# Altium schematic sheet TopSheet.schdoc: Top Sheet
size A4; Organization1: Sciences of Technology Buchs; Size: A4
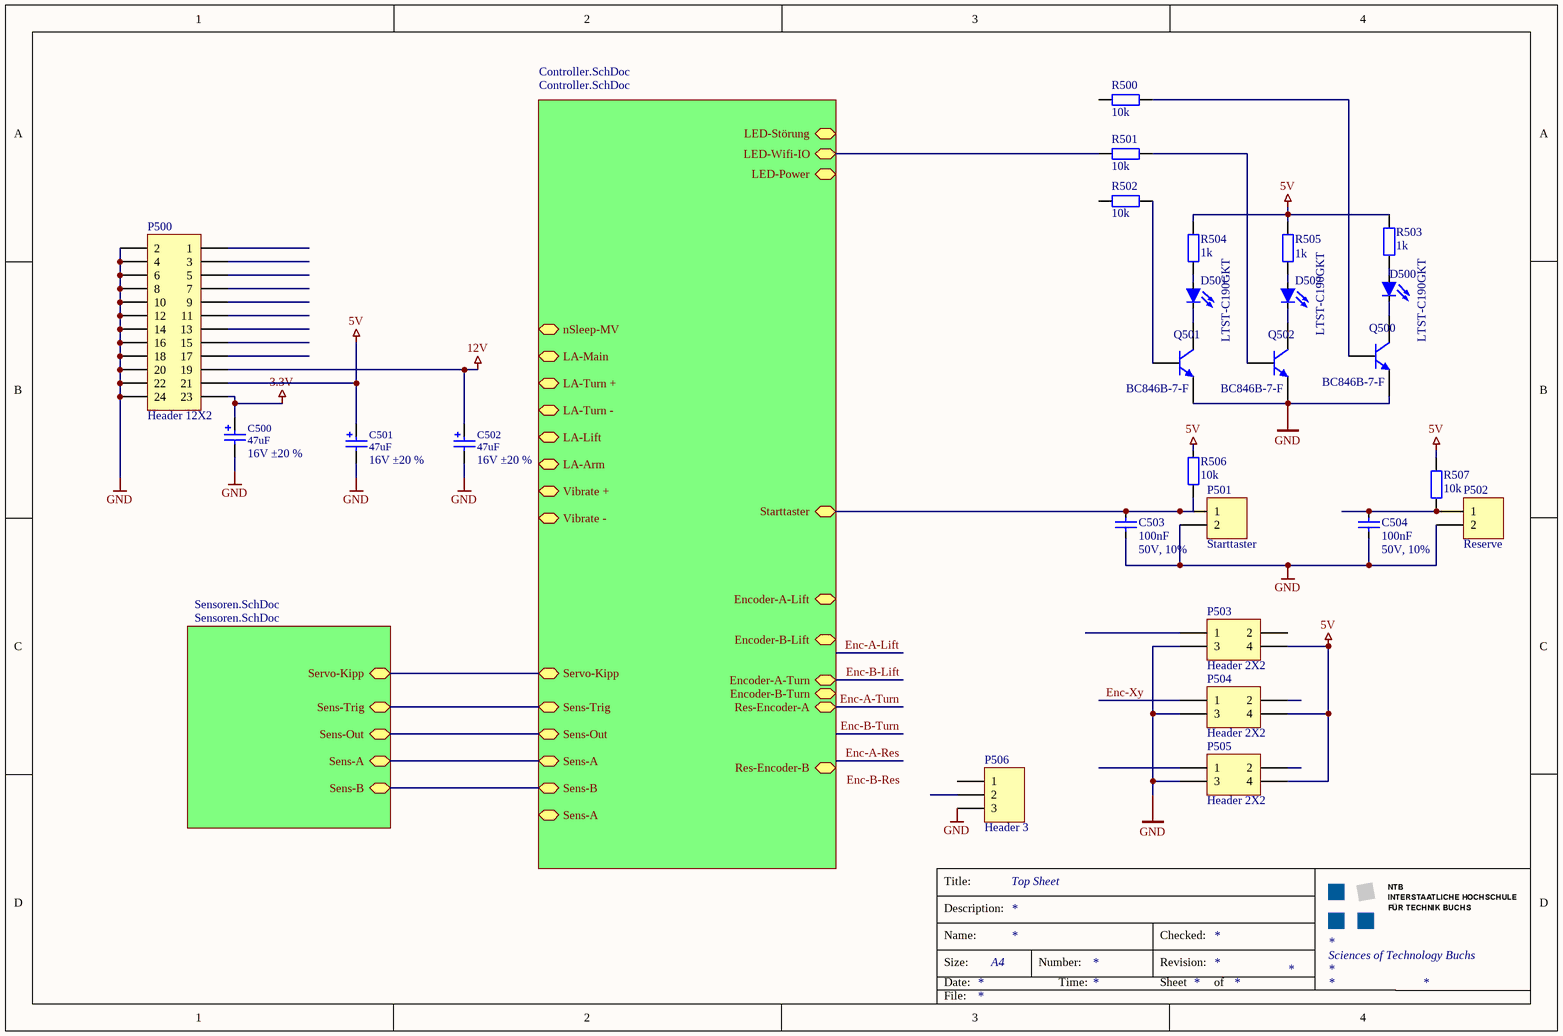
[diagram p0: TopSheet.schdoc]

## Parts
C500  value 47uF  ValueAddon: 16V ±20 %  [CDE_CAP AVE CODE D_H]  (hidden comment: AVE476M16D16T-F)
C501  value 47uF  ValueAddon: 16V ±20 %  [CDE_CAP AVE CODE D_H]  (hidden comment: AVE476M16D16T-F)
C502  value 47uF  ValueAddon: 16V ±20 %  [CDE_CAP AVE CODE D_H]  (hidden comment: AVE476M16D16T-F)
C503  100nF  ValAddon: 50V, 10%  [CAP-0805[2012]]
C504  100nF  ValAddon: 50V, 10%  [CAP-0805[2012]]
D500  LTST-C190GKT  [LED 0603 green]
D501  LTST-C190GKT  [LED 0603 green]
D502  LTST-C190GKT  [LED 0603 green]
P500  Header 12X2  [HDR2X12]
P501  Starttaster  [HDR1X2]
P502  Reserve  [HDR1X2]
P503  Header 2X2  [HDR2X2]
P504  Header 2X2  [HDR2X2]
P505  Header 2X2  [HDR2X2]
P506  Header 3  [HDR1X3]
Q500  BC846B-7-F  [SOT-23]
Q501  BC846B-7-F  [SOT-23]
Q502  BC846B-7-F  [SOT-23]
R500  10k  [RES-0805[2012]]
R501  10k  [RES-0805[2012]]
R502  10k  [RES-0805[2012]]
R503  1k  [RES-0805[2012]]
R504  1k  [RES-0805[2012]]
R505  1k  [RES-0805[2012]]
R506  10k  [RES-0805[2012]]
R507  10k  [RES-0805[2012]]

## Sub-sheets
Controller.SchDoc = Controller.SchDoc: Encoder-A-Lift, Sens-Trig (bidir), Sens-Out, Sens-A, Sens-B (bidir), Starttaster, LED-Power (bidir), LED-Wifi-IO, LED-Störung (bidir), LA-Main, LA-Turn +, LA-Lift, LA-Arm, Vibrate + (bidir), Encoder-B-Lift, Encoder-A-Turn, Encoder-B-Turn, Res-Encoder-A, Res-Encoder-B, Servo-Kipp, nSleep-MV, LA-Turn -, Vibrate -, Sens-A (bidir)
Sensoren.SchDoc = Sensoren.SchDoc: Sens-Trig, Sens-Out, Sens-A, Sens-B, Servo-Kipp

## Nets
3.3V: C500.1(Pos) P500.23
5V: C501.1(Pos) P500.21 P503.4 P504.4 P505.4 R503.2 R504.2 R505.2 R506.2 R507.2
12V: C502.1(Pos) P500.19
GND: C500.2(Neg) C501.2(Neg) C502.2(Neg) C503.1(Pos) C504.1(Pos) P500.2 P500.4 P500.6 P500.8 P500.10 P500.12 P500.14 P500.16 P500.18 P500.20 P500.22 P500.24 P501.2 P502.2 P503.3 P504.3 P505.3 P506.3 Q500.2(E) Q501.2(E) Q502.2(E)
Enc-A-Turn: sheet Controller.SchDoc/Res-Encoder-A
Enc-B-Lift: sheet Controller.SchDoc/Encoder-A-Turn
Enc-Xy: P504.1
NetC503_2: C503.2(Neg) P501.1 R506.1 ; sheet Controller.SchDoc/Starttaster
NetC504_2: C504.2(Neg) P502.1 R507.1
NetD500_1: D500.1(K) Q500.3(C)
NetD500_2: D500.2(A) R503.1
NetD501_1: D501.1(K) Q501.3(C)
NetD501_2: D501.2(A) R504.1
NetD502_1: D502.1(K) Q502.3(C)
NetD502_2: D502.2(A) R505.1
NetQ500_1: Q500.1(B) R500.2
NetQ501_1: Q501.1(B) R502.2
NetQ502_1: Q502.1(B) R501.2
NetR501_1: R501.1 ; sheet Controller.SchDoc/LED-Wifi-IO
(unnamed): sheet Controller.SchDoc/Sens-Trig, sheet Sensoren.SchDoc/Sens-Trig
(unnamed): sheet Controller.SchDoc/Sens-Out, sheet Sensoren.SchDoc/Sens-Out
(unnamed): sheet Controller.SchDoc/Sens-A, sheet Sensoren.SchDoc/Sens-A
(unnamed): sheet Controller.SchDoc/Sens-B, sheet Sensoren.SchDoc/Sens-B
(unnamed): sheet Controller.SchDoc/Servo-Kipp, sheet Sensoren.SchDoc/Servo-Kipp

Not connected (* = marked no-connect by the designer): P500 1 3 5 7 9 11 13 15 17; P503 1 2; P504 2; P505 1 2; P506 1 2; R500 1; R502 1

## Notes on the sheet
- Labels drawn without touching a wire or pin: Enc-B-Res
- Title:
- Description:
- Size:
- Date:
- Name:
- Number:
- Time:
- Revision:
- Sheet
- Checked:
- of
- File:

## Library data of the parts
C500-C502 = ELKO 47uF 16V: ELKO, 47uF, 16V, CDE_AVE476M16D16T-F_AVE CODE D; Manufacturer: Cornell Dubilier; #Class: PASSIVE; #ClassSub: CAPACITOR; RefFootprint: CDE_CAP AVE CODE D; Distributor PartNr: 598-AVE476M16D16T-F; Distributor: Mouser; Published: 20121220; Publisher: Stefan Ursella, M.Eng; ComponentLink1Description: Manufacturer Link; ComponentLink2Description: Datasheet; ComponentLink2URL: http://www.cde.com/catalogs/AVE.pdf; ComponentLink3Description: Packaging Specification; Manufacturer PartNr: AVE476M16D16T-F; RefFileFOO: *; RefFileSCH: *; RefSchema: CDE_AVE476M16D16T-F_AVE CODE D; ClassName: Connect_Full
C503 C504 = MLCC 0805 100n 50V: 100n 50V X7R MLCC 0805 (1608 Metric); Tolerance: 10%; Case-EIA: 0803; Case-Metric: 2013; Rated Voltage: 50V; Temperature Characteristics EIA: X7R; Temperature Range EIA: -55C/+125C; Value: 100nF
D500-D502 = LED Green: LED SMD 0603 green 6mcd; Forward Current: 30mA; Forward Voltage: 2.1V; Spectrum: 565nm; Color: green; ComponentLink1Description: Datasheet LTST-C190GKT; ComponentLink1URL: V:\Diodes\Lite-On-LTST-C190GKT.pdf
P500 = Header 12X2: Header, 12-Pin, Dual row; LatestRevisionDate: 17-Jul-2002; LatestRevisionNote: Re-released for DXP Platform.; Publisher: Altium Limited
P501 P502 = Header 2: Header, 2-Pin; LatestRevisionDate: 17-Jul-2002; LatestRevisionNote: Re-released for DXP Platform.; Publisher: Altium Limited
P503-P505 = Header 2X2: Header, 2-Pin, Dual row; LatestRevisionDate: 17-Jul-2002; LatestRevisionNote: Re-released for DXP Platform.; Publisher: Altium Limited
P506 = Header 3: Header, 3-Pin; LatestRevisionDate: 17-Jul-2002; LatestRevisionNote: Re-released for DXP Platform.; Publisher: Altium Limited
Q500-Q502 = BC846B-SOT23: NPN General-purpose Transistor; Manufacturer: DIODES INC; #Class: SEMICONDUCTOR-TRANSISTOR; #ClassSub: BJT-NPN; RefFootprint: DIODS_SOT23_1B2E3C_3_H; RefSchema: DIODS_BC846B-7-F_SOT23; Published: 17-Sep-2003; Publisher: Altium Limited; ComponentLink1Description: Manufacturer Link; ComponentLink1URL: http://www.diodes.com/products/catalog/detail.php?item-id=6689&popup=datasheet; ComponentLink2Description: Datasheet; ComponentLink2URL: http://www.diodes.com/datasheets/ds11108.pdf; ComponentLink3Description: Packaging Specification; ComponentLink3URL: http://www.diodes.com/datasheets/ap02001.pdf; Distributor: Farnell; Manufacturer PartNr: BC846B-7-F; Distributor PartNr: 1773617; Status: nLager; RefFileFOO: *; RefFileSCH: *
R500-R507 = RES 0805: 0805 (2013 Metric) 1/10 W 10K 1 Thick Film Chip Resistor; Power: 1/10 W; Case-EIA: 0805; Case-Metric: 2013; Tolerance: 1%; Temp. Coefficent: ±100ppm; Technology: SMT; Value: 10k